# EAGLE design FreedomWing1.1 (EAGLE 9.6.2)
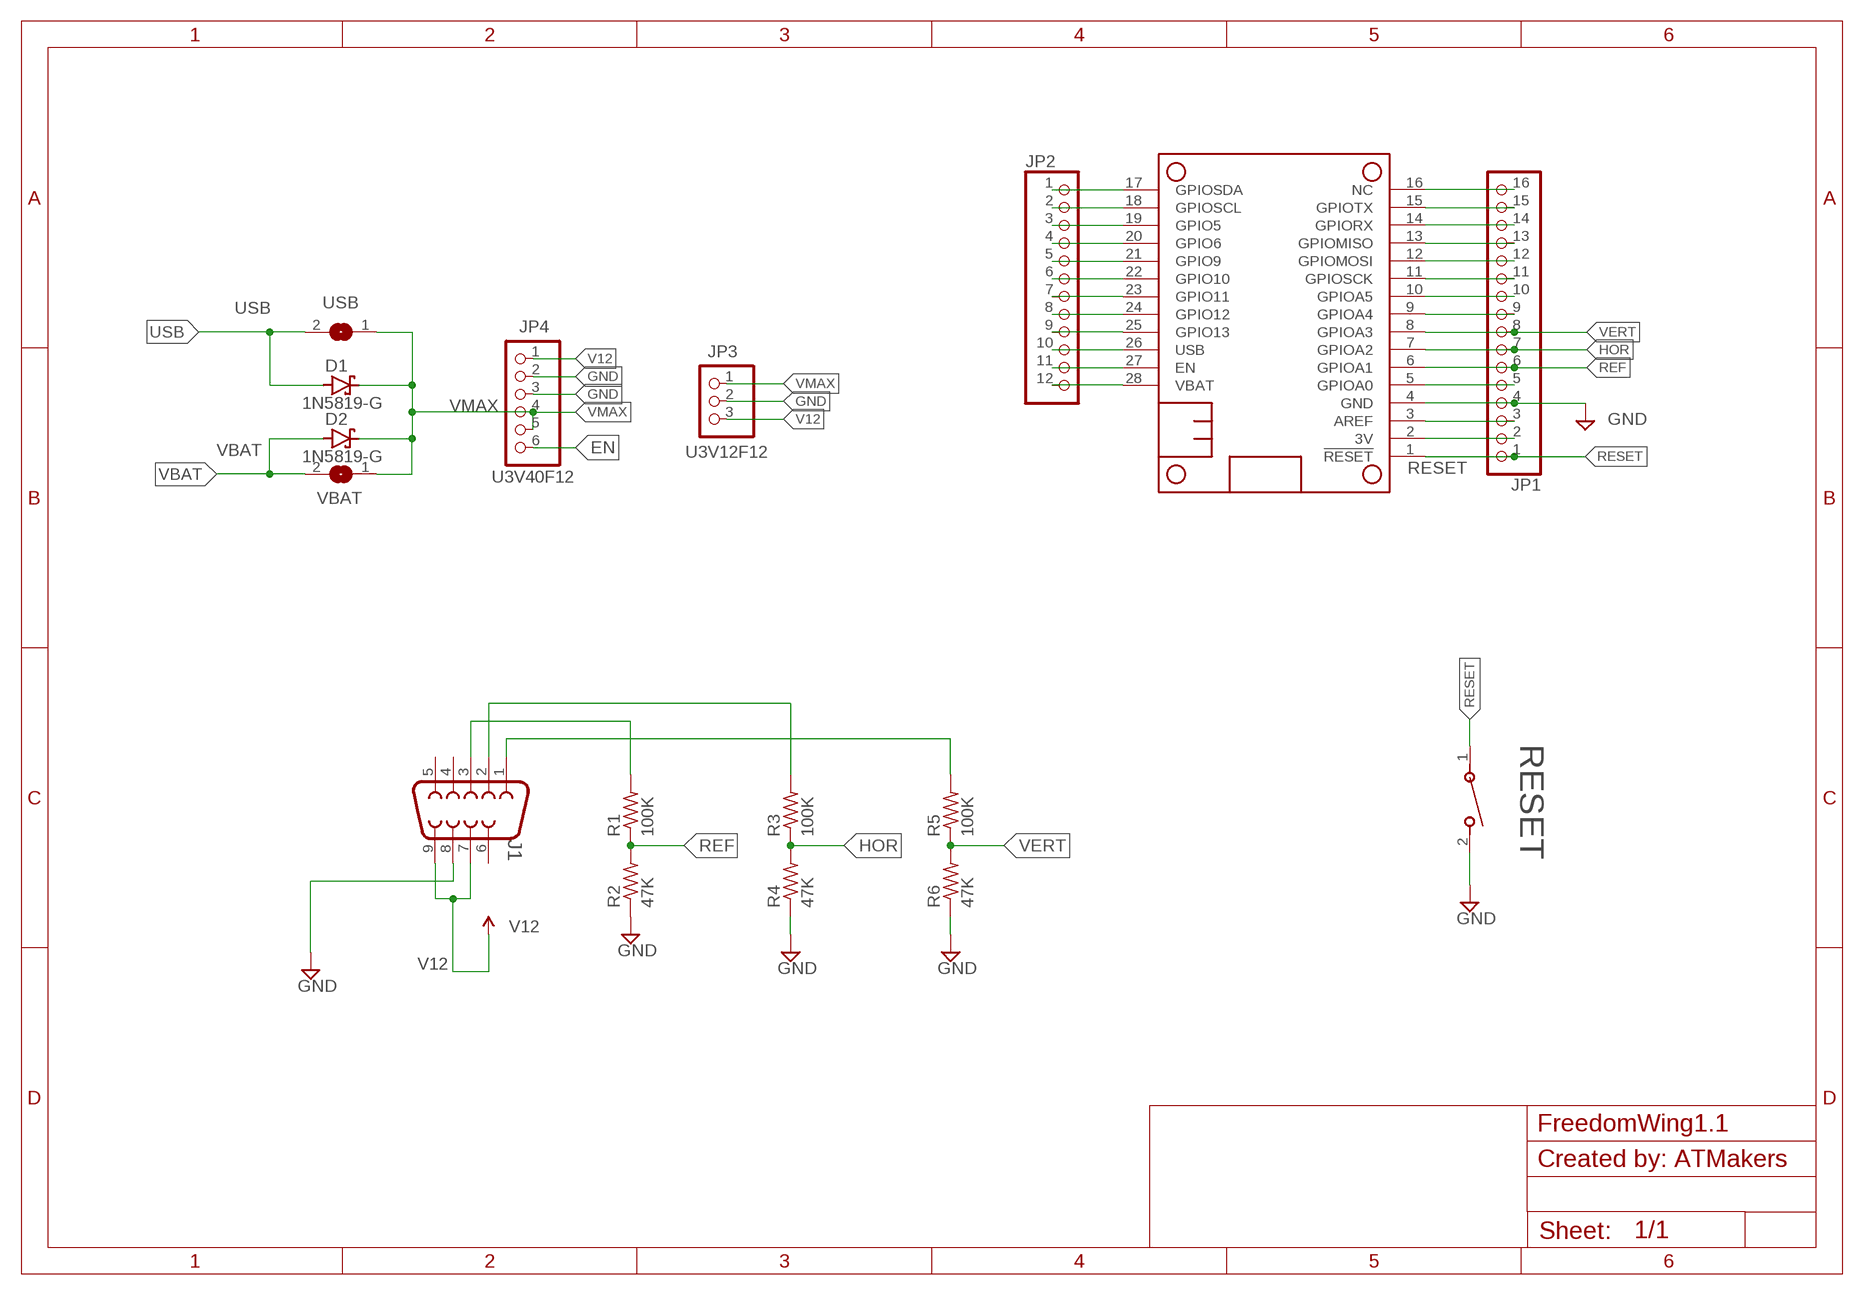
[diagram p0: schematic, sheet 1]

## Parts
D1  1N5819-G  [DO41-7]
D2  1N5819-G  [DO41-7]
J1  5747844-4  DB9_CONNECTOR-MALE  [DB9_CONNECTOR_MALE]
JP1  PINHD-1X16  [1X16]
JP2  PINHD-1X12  [1X12]
JP3  U3V12F12  PINHD-1X3  [1X03]
JP4  U3V40F12  PINHD-1X6  [1X06]
MS1  ADAFRUIT_FEATHER_NODIM  [ADAFRUIT_FEATHERWING_DIM]
R1  100K  RESISTOR-US-0207/10  [RESISTOR_0207/10]
R2  47K  RESISTOR-US-0207/10  [RESISTOR_0207/10]
R3  100K  RESISTOR-US-0207/10  [RESISTOR_0207/10]
R4  47K  RESISTOR-US-0207/10  [RESISTOR_0207/10]
R5  100K  RESISTOR-US-0207/10  [RESISTOR_0207/10]
R6  47K  RESISTOR-US-0207/10  [RESISTOR_0207/10]
RESET  SWITCH_SPST-NO  [SWITCH_SPST-NO]
USB  SJW  [SJW]
VBAT  SJW  [SJW]

## Nets
3V: JP1.2 MS1.2(3V)
EN: JP4.6
GND: J1.8 JP1.4 JP3.2 JP4.2 JP4.3 MS1.4(GND) R2.1 R4.1 R6.1 RESET.2
HOR: JP1.7 MS1.7(GPIOA2) R3.1 R4.2
N$1: J1.3 R1.2
N$2: JP2.1 MS1.17(GPIOSDA)
N$3: JP2.2 MS1.18(GPIOSCL)
N$4: JP2.3 MS1.19(GPIO5)
N$5: JP1.9 MS1.9(GPIOA4)
N$9: J1.2 R3.2
N$10: J1.1 R5.2
N$11: JP2.4 MS1.20(GPIO6)
N$12: JP2.5 MS1.21(GPIO9)
N$13: JP2.6 MS1.22(GPIO10)
N$14: JP2.7 MS1.23(GPIO11)
N$15: JP2.8 MS1.24(GPIO12)
N$16: JP2.9 MS1.25(GPIO13)
N$17: JP1.10 MS1.10(GPIOA5)
N$18: JP1.16 MS1.16(NC)
N$19: JP1.15 MS1.15(GPIOTX)
N$20: JP1.14 MS1.14(GPIORX)
N$21: JP1.13 MS1.13(GPIOMISO)
N$22: JP1.12 MS1.12(GPIOMOSI)
N$23: JP1.11 MS1.11(GPIOSCK)
N$24: JP2.11 MS1.27(EN)
N$27: JP1.3 MS1.3(AREF)
N$30: JP1.5 MS1.5(GPIOA0)
REF: JP1.6 MS1.6(GPIOA1) R1.1 R2.2
RESET: JP1.1 MS1.1(!RESET) RESET.1
USB: D1.A JP2.10 MS1.26(USB) USB.2
V12: J1.7 J1.9 JP3.3 JP4.1
VBAT: D2.A JP2.12 MS1.28(VBAT) VBAT.2
VERT: JP1.8 MS1.8(GPIOA3) R5.1 R6.2
VMAX: D1.C D2.C JP3.1 JP4.4 JP4.5 USB.1 VBAT.1
Unconnected: J1.4 J1.5 J1.6

## Notes on the sheet
- Created by: ATMakers

## Library data of the parts
D1 D2 = MMC Eagle:1N581*: 1.0A SCHOTTKY BARRIER RECTIFIER Source: http://www.diodes.com/datasheets/ds23001.pdf
J1 = MMC Eagle:DB9_CONNECTOR-: DB9 Connector Standard DB9 (D-Sub 9) serial connector. Can be used for CAN bus as well as RS485 and RS232. Footprint production proven. Here is the female version connector we sell at SparkFun: 9 Pin Female Serial Connector - PCB Mount <https://www.sparkfun.com/products/429> (PRT-00429) This connector has been used on the following SparkFun products: SparkFun RS232 Shifter - SMD <https://www.sparkfun.com/products/449> (PRT-00449) SparkFun RS232 Shifter SMD (No DB9) <https://www.sparkfun.com/products/8780> (PRT-08780); PROD_ID: CONN-09904
JP1 = pinhead:PINHD-1X16: PIN HEADER
JP2 = pinhead:PINHD-1X12: PIN HEADER
JP3 = pinhead:PINHD-1X3: PIN HEADER
JP4 = pinhead:PINHD-1X6: PIN HEADER
MS1 = MMC Eagle:ADAFRUIT_FEATHER: Adafruit Feather Feather is a flexible and powerful family of microcontroller main-boards (Feathers​) and daughter-boards (Wings) with a wide range of capabilities. Options: Adafruit - Adafruit Feather Boards <https://www.adafruit.com/category/830> Adafruit - Adafruit Feather Wings <https://www.adafruit.com/category/871>
R1-R6 = MMC Eagle:RESISTOR-US-: RESISTOR, American symbol
RESET = MMC Eagle:SWITCH_SPST-NO; BUILT_BY: EMA_UL_Team; COPYRIGHT: Copyright (C) 2016 Accelerated Designs. All rights reserved; MANUFACTURER_PART_NUMBER: 1825966-1; VENDOR: TE Connectivity
USB VBAT = jumper:SJ: SMD solder JUMPER

## Board
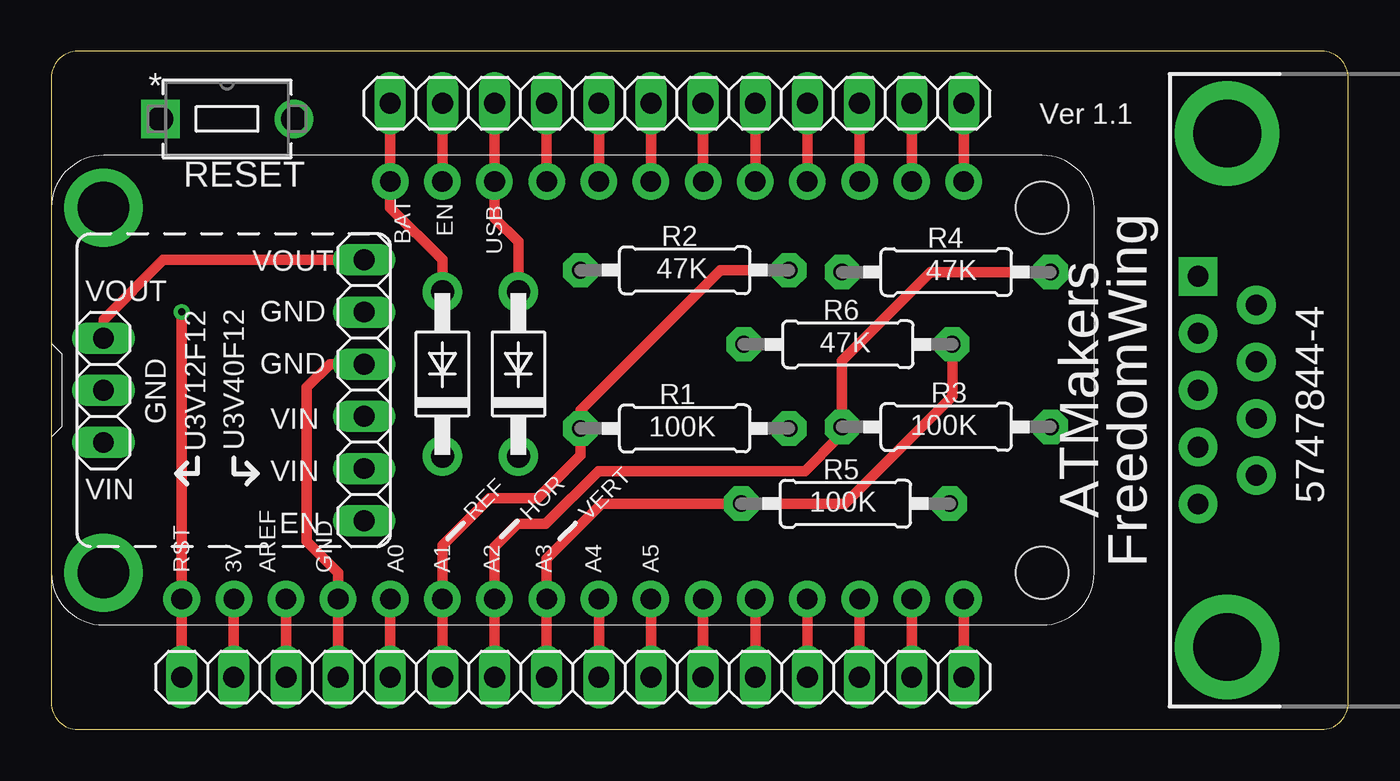
[diagram p1: board, top side]
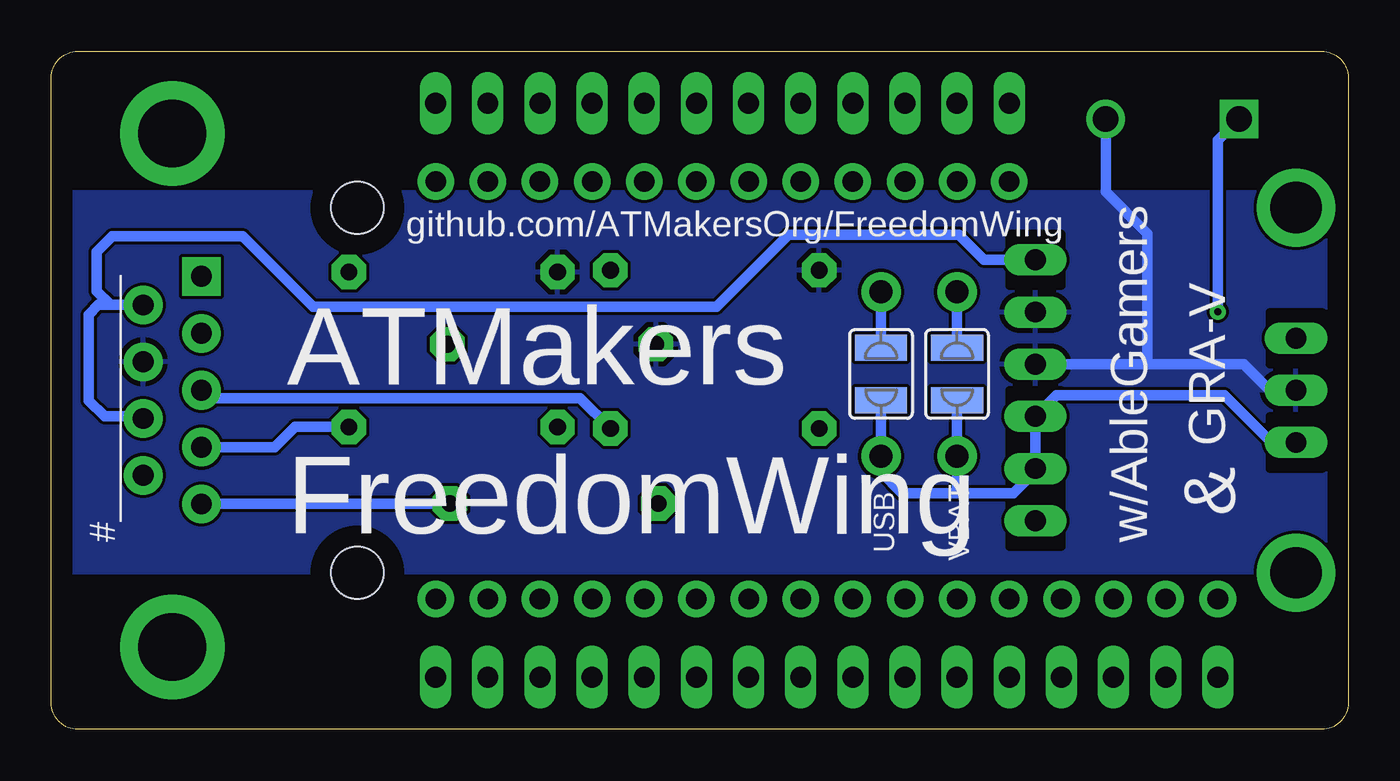
[diagram p2: board, bottom side, seen from below]

Size 63.17 x 33.01 mm. Coordinates in mm from the lower left corner, seen from the top.
Outline: 0,31.74 0,1.27 arc90 1.27,0 61.9,0 arc90 63.17,1.27 63.17,31.74 arc90 61.9,33.01 1.27,33.01 arc90 0,31.74
Copper layers (1*16): Top 0.035mm / dielectric 1.5mm / Bottom 0.035mm
Design rules "default *": minimum track width 6mil, minimum drill 0.35mm, track to track 6mil, track to pad 6mil, pad to pad 6mil, via to via 6mil, smd to smd 6mil, copper to edge 40mil, drill to drill 6mil, minimum pad ring 10mil, minimum via ring 8mil, stop-mask expansion 4mil, vias tented up to drill 20mil, thermal gap 10mil

### Footprints (pad centres in the part's own frame; a part is rotated, then mirrored left to right if it is on the bottom)
DO41-7 = drill 1.118 pad 1.93: A 4,0; C -4,0
DB9_CONNECTOR_MALE = drill 1.016 pad 1.88: 1 5.54,-1.42; 2 2.77,-1.42; 3 0,-1.42; 4 -2.77,-1.42; 6 4.15,1.42; 7 1.38,1.42; 8 -1.38,1.42; 9 -4.15,1.42 | drill 1.016 pad 1.88 square: 5 -5.54,-1.42 | drill 3.302 pad 5.08: G1 -12.5,0; G2 12.5,0
1X16 = drill 1.016 long: 1 -19.05,0; 2 -16.51,0; 3 -13.97,0; 4 -11.43,0; 5 -8.89,0; 6 -6.35,0; 7 -3.81,0; 8 -1.27,0; 9 1.27,0; 10 3.81,0; 11 6.35,0; 12 8.89,0; 13 11.43,0; 14 13.97,0; 15 16.51,0; 16 19.05,0
1X12 = drill 1.016 long: 1 -13.97,0; 2 -11.43,0; 3 -8.89,0; 4 -6.35,0; 5 -3.81,0; 6 -1.27,0; 7 1.27,0; 8 3.81,0; 9 6.35,0; 10 8.89,0; 11 11.43,0; 12 13.97,0
1X03 = drill 1.016 long: 1 -2.54,0; 2 0,0; 3 2.54,0
1X06 = drill 1.016 long: 1 -6.35,0; 2 -3.81,0; 3 -1.27,0; 4 1.27,0; 5 3.81,0; 6 6.35,0
ADAFRUIT_FEATHERWING_DIM = drill 1 pad 1.778: 1 6.35,1.27; 2 8.89,1.27; 3 11.43,1.27; 4 13.97,1.27; 5 16.51,1.27; 6 19.05,1.27; 7 21.59,1.27; 8 24.13,1.27; 9 26.67,1.27; 10 29.21,1.27; 11 31.75,1.27; 12 34.29,1.27; 13 36.83,1.27; 14 39.37,1.27; 15 41.91,1.27; 16 44.45,1.27; 17 44.45,21.59; 18 41.91,21.59; 19 39.37,21.59; 20 36.83,21.59; 21 34.29,21.59; 22 31.75,21.59; 23 29.21,21.59; 24 26.67,21.59; 25 24.13,21.59; 26 21.59,21.59; 27 19.05,21.59; 28 16.51,21.59 | drill 2.5 pad 3.81: P$1 2.54,20.32; P$2 2.54,2.54 | hole 2.54: 48.26,20.32; 48.26,2.54
RESISTOR_0207/10 = drill 0.813 pad 1.676 octagon: 1 -5.08,0; 2 5.08,0
SWITCH_SPST-NO = drill 1.245 pad 1.753 square: 1 -6.502,0 | drill 1.245 pad 1.753: 2 0,0
SJW = smd 1.27 x 2.54: 1 -1.27,0; 2 1.27,0

### Placement (x,y rotation side)
D1  22.75,17.3 90 top
D2  19.05,17.3 90 top
J1  57.28,16.51 270 top
JP1  25.4,2.54 0 top
JP2  30.48,30.48 180 top
JP3  2.54,16.5 90 top
JP4  15.24,16.5 270 top
MS1  0,5.08 0 top
R1  30.85,14.65 0 top
R2  30.85,22.35 0 top
R3  43.59,14.72 0 top
R4  43.59,22.26 0 top
R5  38.68,10.99 0 top
R6  38.8,18.75 0 top
RESET  11.81,29.72 0 top
USB  22.75,17.3 90 bottom
VBAT  19.05,17.3 90 bottom

### Tracks (layer width: path | path; a pad name or v marks a point on that pad's centre or on a via)
3V
  Top 0.508: MS1.2 JP1.2
GND
  Top 0.508: JP1.4 MS1.4 13.97,7.62 12.45,9.14 12.45,16.64 13.58,17.77 JP4.3
  Bottom 0.508: RESET.2 11.81,26.16 9.78,24.13 9.78,17.77 | JP3.2 3.82,16.5 5.09,17.77 9.78,17.77 | 9.78,17.77 JP4.3
  pour Bottom: 0,26.16 62.23,26.16 62.23,7.62 0,7.62
  cutout Bottom: 16.51,16.5 16.51,8.88 15.3,8.88 13.97,8.88 13.97,16.5
  cutout Bottom: 13.97,24.12 16.51,24.12 16.51,21.59 13.97,21.59
  cutout Bottom: 1.27,20.32 3.81,20.32 3.81,17.77 1.27,17.77
  cutout Bottom: 1.27,15.23 3.81,15.23 3.81,12.7 1.27,12.7
HOR
  Top 0.508: R4.2 42.83,22.26 38.51,17.95 R3.1 38.34,14.22 36.7,12.57 26.65,12.57 24.08,10 22.7,10 21.59,8.89 MS1.7 JP1.7
N$1
  Bottom 0.508: R1.2 37.41,16.13 55.48,16.13 J1.3
N$2
  Top 0.508: MS1.17 JP2.1
N$3
  Top 0.508: JP2.2 MS1.18
N$4
  Top 0.508: MS1.19 JP2.3
N$5
  Top 0.508: MS1.9 JP1.9
N$9
  Bottom 0.508: R3.2 51.3,14.72 52.28,13.74 J1.2
N$10
  Bottom 0.508: J1.1 55.84,10.99 R5.2
N$11
  Top 0.508: JP2.4 MS1.20
N$12
  Top 0.508: MS1.21 JP2.5
N$13
  Top 0.508: JP2.6 MS1.22
N$14
  Top 0.508: MS1.23 JP2.7
N$15
  Top 0.508: JP2.8 MS1.24
N$16
  Top 0.508: MS1.25 JP2.9
N$17
  Top 0.508: JP1.10 MS1.10
N$18
  Top 0.508: MS1.16 JP1.16
N$19
  Top 0.508: MS1.15 JP1.15
N$20
  Top 0.508: MS1.14 JP1.14
N$21
  Top 0.508: MS1.13 JP1.13
N$22
  Top 0.508: MS1.12 JP1.12
N$23
  Top 0.508: MS1.11 JP1.11
N$24
  Top 0.508: MS1.27 JP2.11
N$27
  Top 0.508: JP1.3 MS1.3
N$30
  Top 0.508: MS1.5 JP1.5
REF
  Top 0.508: R2.2 32.59,22.35 25.77,15.54 R1.1 25.77,13.33 23.69,11.25 21.35,11.25 19.05,8.95 MS1.6 JP1.6
RESET  (via drill 0.35)
  Top 0.508: JP1.1 MS1.1 v6.35,20.32
  Bottom 0.508: v6.35,20.32 6.35,28.68 RESET.1
USB
  Top 0.508: D1.A 22.75,23.73 21.59,24.89 MS1.26 JP2.10
  Bottom 0.508: USB.2 D1.A
V12
  Top 0.508: JP3.3 2.54,19.94 5.45,22.86 JP4.1
  Bottom 0.508: J1.7 58.81,15.24 60.58,15.24 61.34,16 61.34,20.19 60.87,20.66 60.28,20.66 | 60.28,20.66 60.96,21.34 60.96,23.24 60.2,24 53.85,24 50.42,20.57 30.77,20.57 27.27,24.08 18.97,24.08 17.75,22.86 JP4.1 | 60.28,20.66 J1.9
VBAT
  Top 0.508: JP2.12 MS1.28 16.51,25.4 19.05,22.86 D2.A
  Bottom 0.508: D2.A VBAT.2
VERT
  Top 0.508: R6.2 43.88,16.21 38.66,10.99 R5.1 26.81,10.99 24.13,8.31 MS1.8 JP1.8
VMAX
  Bottom 0.508: JP3.1 3.75,13.96 6.04,16.26 14.21,16.26 JP4.4 JP4.5 15.24,12.57 16.3,11.5 19,11.5 | USB.1 D1.C 22.75,12.53 21.73,11.5 19,11.5 | 19,11.5 19.05,11.55 D2.C VBAT.1

### Text on the board
tPlace: Ver 1.1 | BAT | EN | USB | VOUT | VOUT | GND | GND | FreedomWing | GND | VIN | VIN | VIN | 5747844-4 | EN | REF | HOR | VERT | ATMakers | RST | 3V | AREF | GND | A0 | A1 | A2 | A3 | A4 | A5
bPlace: #____________ | ATMakers | FreedomWing
bNames: github.com/ATMakersOrg/FreedomWing | GRA-V | & | w/AbleGamers